# Altium schematic sheet LineCliffSensors.SchDoc
size A
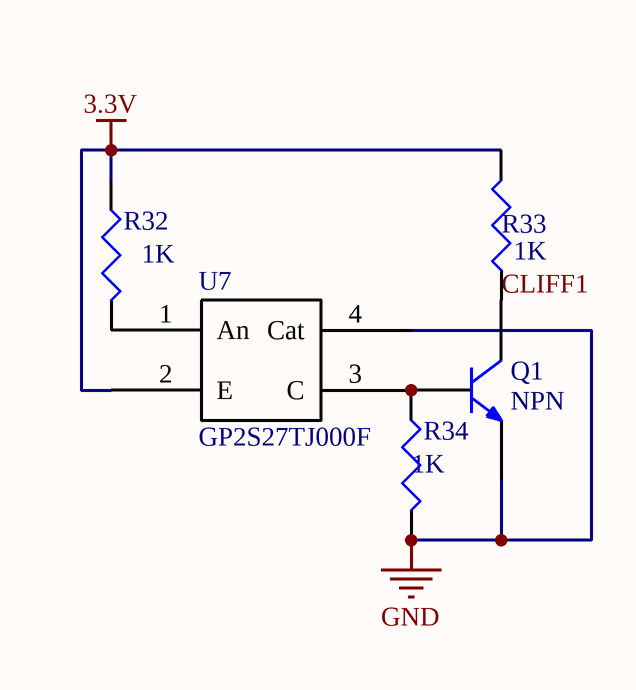
[diagram p0: LineCliffSensors.SchDoc]

## Parts
Q1  NPN  [SOT-23]
R32  value 1K  [RESC1608L]  (hidden comment: Res3)
R33  value 1K  [RESC1608L]  (hidden comment: Res3)
R34  value 1K  [RESC1608L]  (hidden comment: Res3)
U7  GP2S27TJ000F  [GP2S27J0000F]

## Nets
3.3V: R32.1 R33.2 U7.2(E)
GND: Q1.2(E) R34.2 U7.4(Cat)
CLIFF1: Q1.3(C) R33.1
NetQ1_1: Q1.1(B) R34.1 U7.3(C)
NetR32_2: R32.2 U7.1(An)

## Library data of the parts
R32-R34 = Res3: Resistor; Published: 8-Jun-2000; LatestRevisionDate: 29-May-2009; LatestRevisionNote: IPC-7351 Footprint Added.; PackageReference: J1-0603; Publisher: Altium Limited; PackageDescription: Chip Resistor